# EAGLE schematic 1907022249-Dev Board (EAGLE 9.4.2)
DRAFTER: David Antaki; REV: 1; STATUS: ISSUED FOR REVIEW

## Sheet 1 of 3
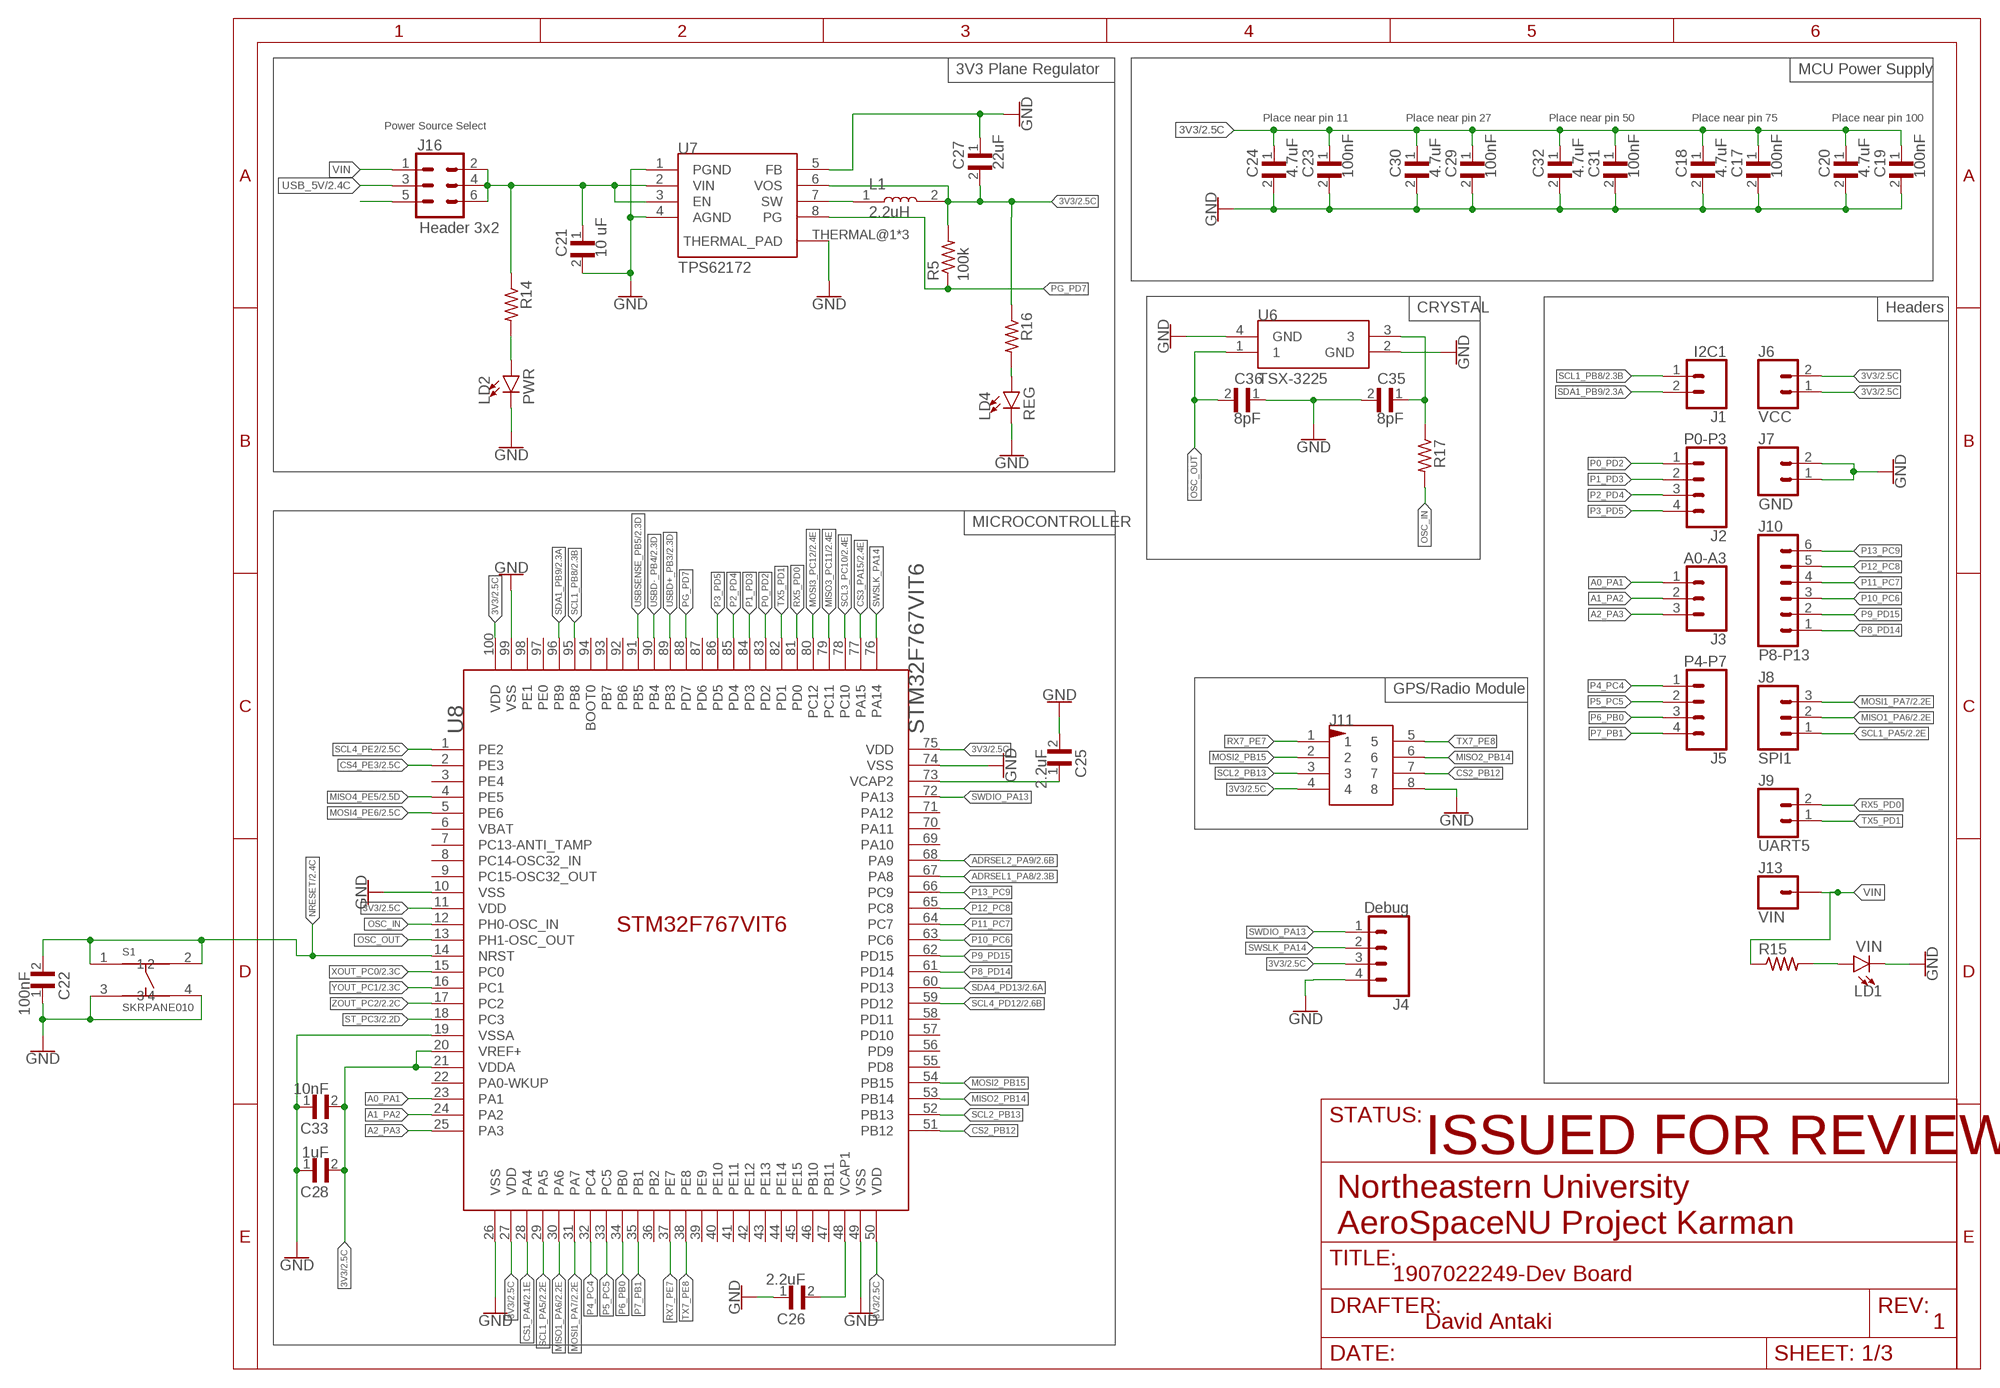
[diagram p0: schematic, sheet 1]

### Parts
C17  100nF  CGA3E2X7R1H104K080AD  [CAPC1608X95N]
C18  4.7uF  CGA3E2X7R1H104K080AD  [CAPC1608X95N]
C19  100nF  CGA3E2X7R1H104K080AD  [CAPC1608X95N]
C20  4.7uF  CGA3E2X7R1H104K080AD  [CAPC1608X95N]
C21  10 uF  CGA3E2X7R1H104K080AD  [CAPC1608X95N]
C22  100nF  CGA3E2X7R1H104K080AD  [CAPC1608X95N]
C23  100nF  CGA3E2X7R1H104K080AD  [CAPC1608X95N]
C24  4.7uF  CGA3E2X7R1H104K080AD  [CAPC1608X95N]
C25  2.2uF  CGA3E2X7R1H104K080AD  [CAPC1608X95N]
C26  2.2uF  CGA3E2X7R1H104K080AD  [CAPC1608X95N]
C27  22uF  CGA3E2X7R1H104K080AD  [CAPC1608X95N]
C28  1uF  CGA3E2X7R1H104K080AD  [CAPC1608X95N]
C29  100nF  CGA3E2X7R1H104K080AD  [CAPC1608X95N]
C30  4.7uF  CGA3E2X7R1H104K080AD  [CAPC1608X95N]
C31  100nF  CGA3E2X7R1H104K080AD  [CAPC1608X95N]
C32  4.7uF  CGA3E2X7R1H104K080AD  [CAPC1608X95N]
C33  10nF  CGA3E2X7R1H104K080AD  [CAPC1608X95N]
C35  8pF  CGA3E2X7R1H104K080AD  [CAPC1608X95N]
C36  8pF  CGA3E2X7R1H104K080AD  [CAPC1608X95N]
J1  I2C1  CONN_02  [1X02]
J2  P0-P3  CONN_04  [1X04]
J3  A0-A3  CONN_03  [1X03]
J4  Debug  CONN_04  [1X04]
J5  P4-P7  CONN_04  [1X04]
J6  VCC  CONN_02  [1X02]
J7  GND  CONN_02  [1X02]
J8  SPI1  CONN_03  [1X03]
J9  UART5  CONN_02  [1X02]
J10  P8-P13  CONN_06SILK_FEMALE_PTH  [1X06]
J11  087831-0819  [87831-0819]
J13  VIN  CONN_01  [1X01]
J16  Header 3x2  CONN_03X22X3_SILK_MALE_PTH  [2X3]
L1  2.2uH  MLF1608E100J  [INDC1608X95N]
LD1  VIN  0805_LED  [0805_LED]
LD2  PWR  0805_LED  [0805_LED]
LD4  REG  0805_LED  [0805_LED]
R5  100k  CRGH0603F221K  [RESC1608X50N]
R14  CRGH0603F221K  [RESC1608X50N]
R15  CRGH0603F221K  [RESC1608X50N]
R16  CRGH0603F221K  [RESC1608X50N]
R17  CRGH0603F221K  [RESC1608X50N]
S1  SKRPANE010  PUSHBUTTONSKRPANE010  [SKRPANE010]
U6  TSX-3225  [TSX-3225]
U7  TPS62172  [TPS62172]
U8  STM32F767VIT6  [LQFP100_14X14]

### Nets
3V3: C17.1 C18.1 C19.1 C20.1 C23.1 C24.1 C27.2 C28.2 C29.1 C30.1 C31.1 C32.1 C33.2 J4.3 J6.1 J6.2 J11.4 L1.2 R5.2 R16.1 U7.6(VOS) U8.11(VDD) U8.20(VREF+) U8.21(VDDA) U8.27(VDD) U8.50(VDD) U8.75(VDD) U8.100(VDD) ; also sheet 2
A0_PA1: J3.1 U8.23(PA1)
A1_PA2: J3.2 U8.24(PA2)
A2_PA3: J3.3 U8.25(PA3)
ADRSEL1_PA8: U8.67(PA8) ; also sheet 2
ADRSEL2_PA9: U8.68(PA9) ; also sheet 2
CS1_PA4: U8.28(PA4) ; also sheet 2
CS2_PB12: J11.7 U8.51(PB12)
CS3_PA15: U8.77(PA15) ; also sheet 2
CS4_PE3: U8.2(PE3) ; also sheet 2
GND: C17.2 C18.2 C19.2 C20.2 C21.2 C22.1 C23.2 C24.2 C25.2 C26.1 C28.1 C29.2 C30.2 C31.2 C32.2 C33.1 C35.2 C36.1 J4.4 J7.1 J7.2 J11.8 LD1.C LD2.C LD4.C S1.3 S1.4 U6.2(GND) U6.4(GND) U7.1(PGND) U7.4(AGND) U7.THERMAL@1(THERMAL_PAD) U7.THERMAL@2(THERMAL_PAD) U7.THERMAL@3(THERMAL_PAD) U8.10(VSS) U8.19(VSSA) U8.26(VSS) U8.49(VSS) U8.74(VSS) U8.99(VSS) ; also sheet 2
MISO1_PA6: J8.2 U8.30(PA6) ; also sheet 2
MISO2_PB14: J11.6 U8.53(PB14)
MISO3_PC11: U8.79(PC11) ; also sheet 2
MISO4_PE5: U8.4(PE5) ; also sheet 2
MOSI1_PA7: J8.3 U8.31(PA7) ; also sheet 2
MOSI2_PB15: J11.2 U8.54(PB15)
MOSI3_PC12: U8.80(PC12) ; also sheet 2
MOSI4_PE6: U8.5(PE6) ; also sheet 2
N$4: C25.1 U8.73(VCAP2)
N$7: C26.2 U8.48(VCAP1)
N$8: L1.1 U7.7(SW)
N$10: LD1.A R15.2
N$11: LD2.A R14.2
N$12: C27.1 U7.5(FB) ; supply symbol labelled GND
N$15: C35.1 R17.1 U6.3
N$17: J16.5
N$18: C21.1 J16.2 J16.4 J16.6 R14.1 U7.2(VIN) U7.3(EN)
N$23: LD4.A R16.2
NRESET: C22.2 S1.1 S1.2 U8.14(NRST) ; also sheet 2
OSC_IN: R17.2 U8.12(PH0-OSC_IN)
OSC_OUT: C36.2 U6.1 U8.13(PH1-OSC_OUT)
P0_PD2: J2.1 U8.83(PD2)
P1_PD3: J2.2 U8.84(PD3)
P2_PD4: J2.3 U8.85(PD4)
P3_PD5: J2.4 U8.86(PD5)
P4_PC4: J5.1 U8.32(PC4)
P5_PC5: J5.2 U8.33(PC5)
P6_PB0: J5.3 U8.34(PB0)
P7_PB1: J5.4 U8.35(PB1)
P8_PD14: J10.1 U8.61(PD14)
P9_PD15: J10.2 U8.62(PD15)
P10_PC6: J10.3 U8.63(PC6)
P11_PC7: J10.4 U8.64(PC7)
P12_PC8: J10.5 U8.65(PC8)
P13_PC9: J10.6 U8.66(PC9)
PG_PD7: R5.1 U7.8(PG) U8.88(PD7)
RX5_PD0: J9.2 U8.81(PD0)
RX7_PE7: J11.1 U8.37(PE7)
SCL1_PA5: J8.1 U8.29(PA5) ; also sheet 2
SCL1_PB8: J1.1 U8.95(PB8) ; also sheet 2
SCL2_PB13: J11.3 U8.52(PB13)
SCL3_PC10: U8.78(PC10) ; also sheet 2
SCL4_PD12: U8.59(PD12) ; also sheet 2
SCL4_PE2: U8.1(PE2) ; also sheet 2
SDA1_PB9: J1.2 U8.96(PB9) ; also sheet 2
SDA4_PD13: U8.60(PD13) ; also sheet 2
ST_PC3: U8.18(PC3) ; also sheet 2
SWDIO_PA13: J4.1 U8.72(PA13)
SWSLK_PA14: J4.2 U8.76(PA14)
TX5_PD1: J9.1 U8.82(PD1)
TX7_PE8: J11.5 U8.38(PE8)
USB_5V: J16.3 ; also sheet 2
USBD+_PB3: U8.89(PB3) ; also sheet 2
USBD-_PB4: U8.90(PB4) ; also sheet 2
USBSENSE_PB5: U8.91(PB5) ; also sheet 2
VIN: J13.1 J16.1 R15.1
XOUT_PC0: U8.15(PC0) ; also sheet 2
YOUT_PC1: U8.16(PC1) ; also sheet 2
ZOUT_PC2: U8.17(PC2) ; also sheet 2
Unconnected: U8.3(PE4) U8.6(VBAT) U8.7(PC13-ANTI_TAMP) U8.8(PC14-OSC32_IN) U8.9(PC15-OSC32_OUT) U8.22(PA0-WKUP) U8.36(PB2) U8.39(PE9) U8.40(PE10) U8.41(PE11) U8.42(PE12) U8.43(PE13) U8.44(PE14) U8.45(PE15) U8.46(PB10) U8.47(PB11) U8.55(PD8) U8.56(PD9) U8.57(PD10) U8.58(PD11) U8.69(PA10) U8.70(PA11) U8.71(PA12) U8.87(PD6) U8.92(PB6) U8.93(PB7) U8.94(BOOT0) U8.97(PE0) U8.98(PE1)

### Notes on the sheet
- 3V3 Plane Regulator | MCU Power Supply
- Place near pin 11 | Place near pin 27 | Place near pin 50 | Place near pin 75 | Place near pin 100
- Power Source Select
- CRYSTAL | Headers
- MICROCONTROLLER
- GPS/Radio Module

## Sheet 2 of 3
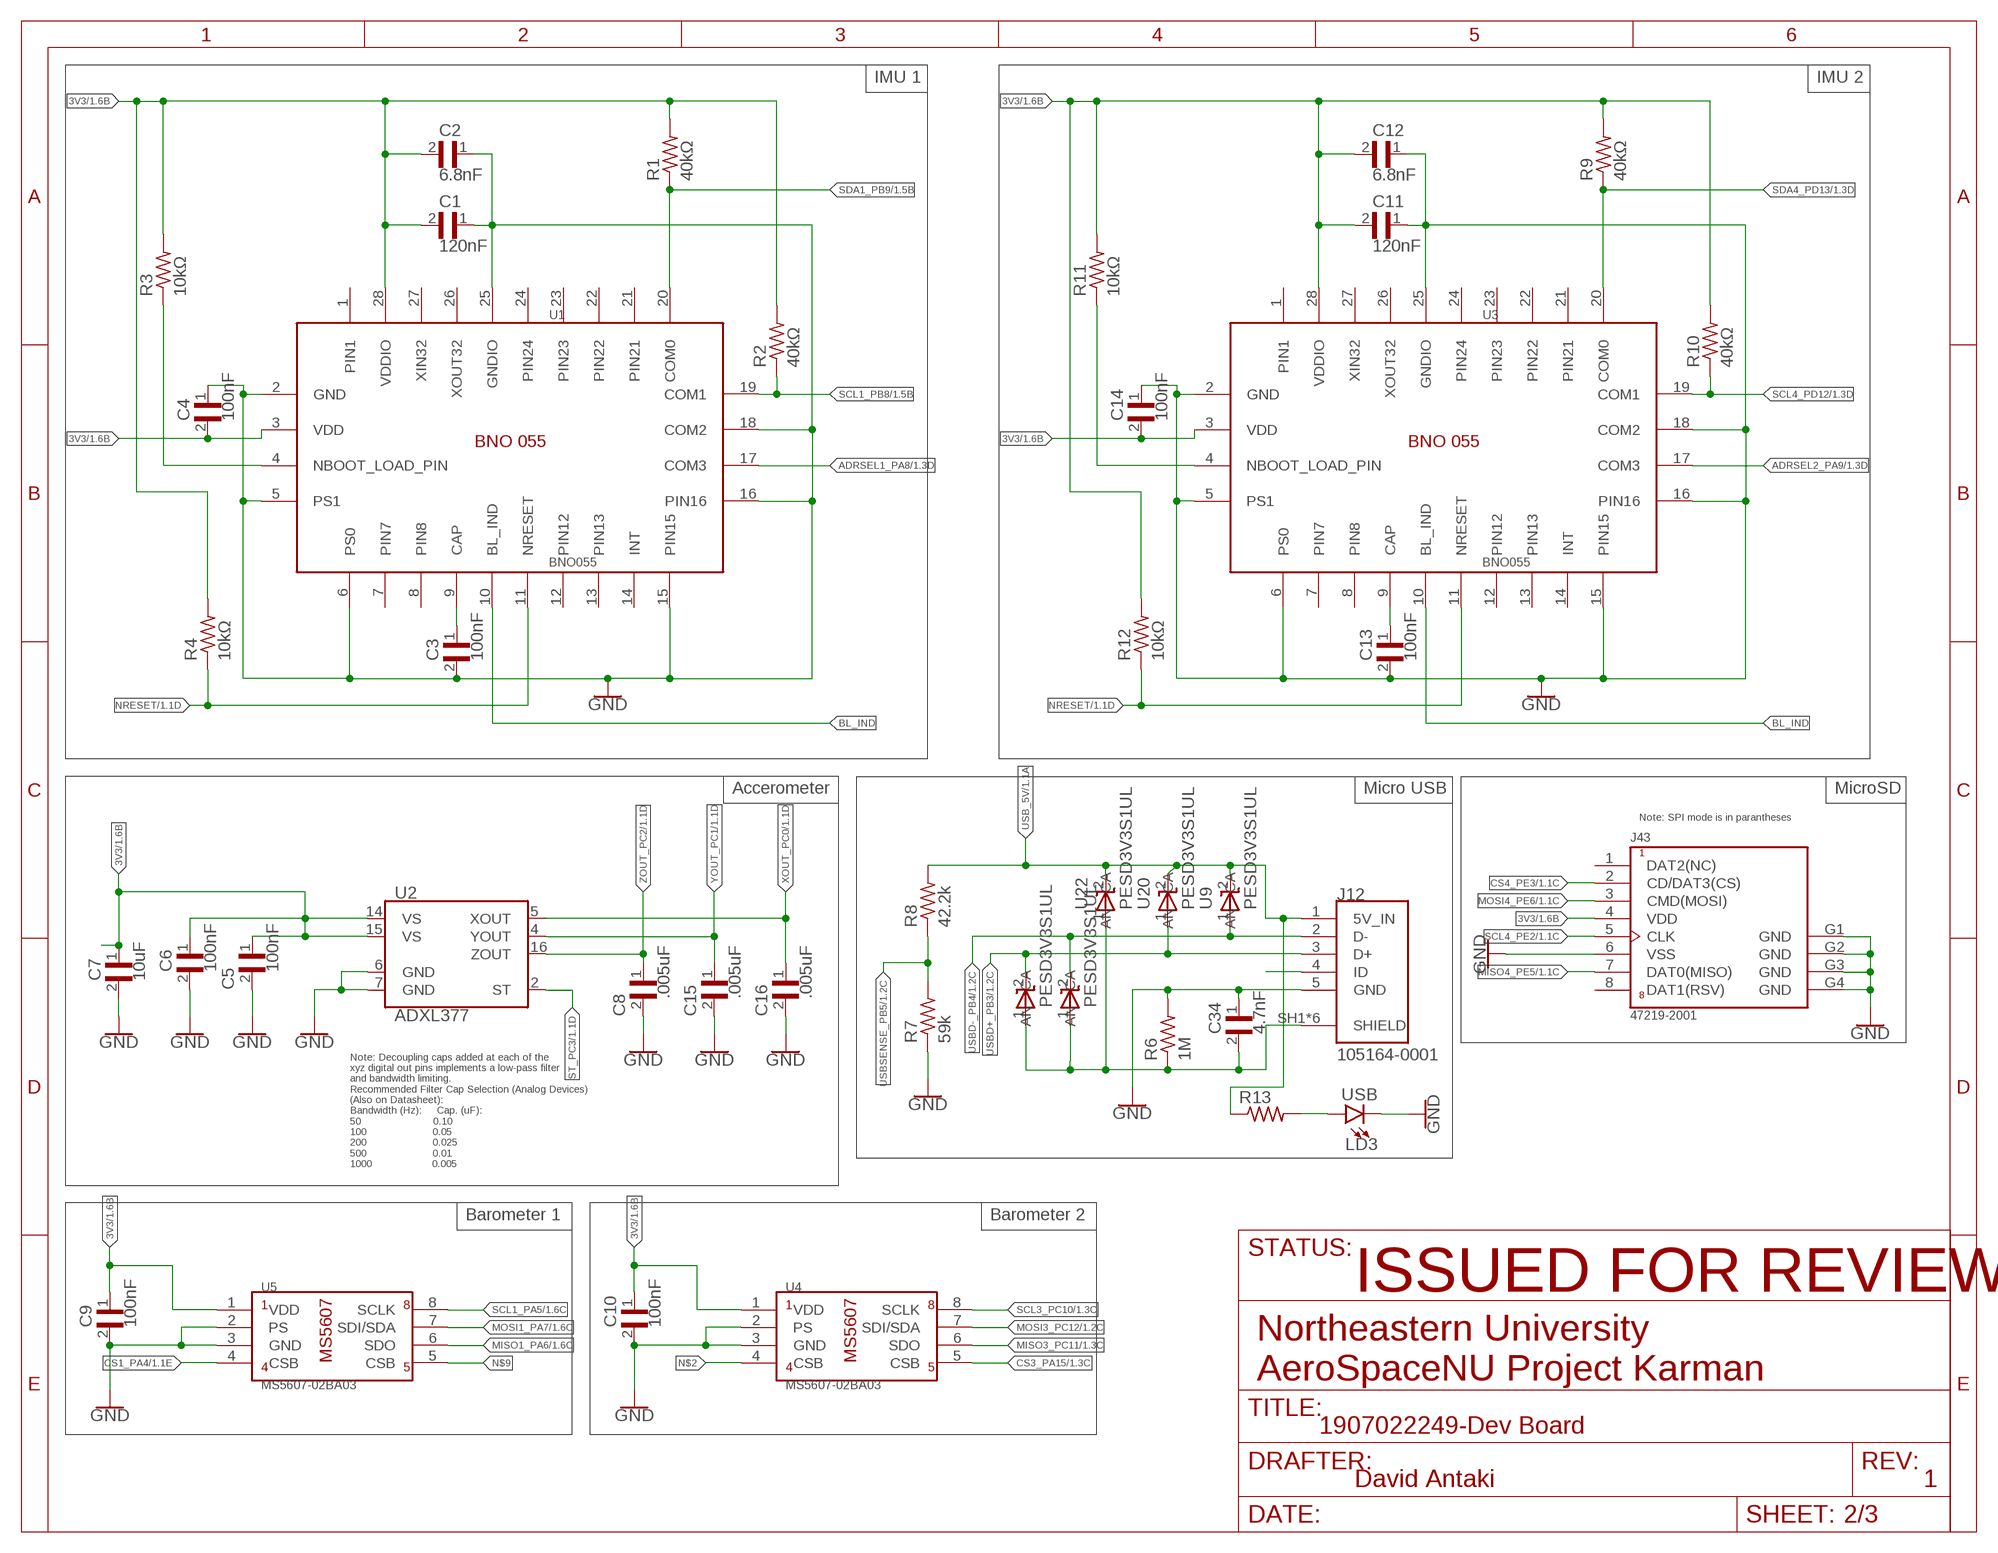
[diagram p1: schematic, sheet 2]

### Parts
C1  120nF  CGA3E2X7R1H104K080AD  [CAPC1608X95N]
C2  6.8nF  CGA3E2X7R1H104K080AD  [CAPC1608X95N]
C3  100nF  CGA3E2X7R1H104K080AD  [CAPC1608X95N]
C4  100nF  CGA3E2X7R1H104K080AD  [CAPC1608X95N]
C5  100nF  CGA3E2X7R1H104K080AD  [CAPC1608X95N]
C6  100nF  CGA3E2X7R1H104K080AD  [CAPC1608X95N]
C7  10uF  CGA3E2X7R1H104K080AD  [CAPC1608X95N]
C8  .005uF  CGA3E2X7R1H104K080AD  [CAPC1608X95N]
C9  100nF  CGA3E2X7R1H104K080AD  [CAPC1608X95N]
C10  100nF  CGA3E2X7R1H104K080AD  [CAPC1608X95N]
C11  120nF  CGA3E2X7R1H104K080AD  [CAPC1608X95N]
C12  6.8nF  CGA3E2X7R1H104K080AD  [CAPC1608X95N]
C13  100nF  CGA3E2X7R1H104K080AD  [CAPC1608X95N]
C14  100nF  CGA3E2X7R1H104K080AD  [CAPC1608X95N]
C15  .005uF  CGA3E2X7R1H104K080AD  [CAPC1608X95N]
C16  .005uF  CGA3E2X7R1H104K080AD  [CAPC1608X95N]
C34  4.7nF  CGA3E2X7R1H104K080AD  [CAPC1608X95N]
J12  105164-0001  [MOLEX_105164-0001]
J43  47219-2001  [MOLEX_47219-2001]
LD3  USB  0805_LED  [0805_LED]
R1  40kΩ  CRGH0603F221K  [RESC1608X50N]
R2  40kΩ  CRGH0603F221K  [RESC1608X50N]
R3  10kΩ  CRGH0603F221K  [RESC1608X50N]
R4  10kΩ  CRGH0603F221K  [RESC1608X50N]
R6  1M  CRGH0603F221K  [RESC1608X50N]
R7  59k  CRGH0603F221K  [RESC1608X50N]
R8  42.2k  CRGH0603F221K  [RESC1608X50N]
R9  40kΩ  CRGH0603F221K  [RESC1608X50N]
R10  40kΩ  CRGH0603F221K  [RESC1608X50N]
R11  10kΩ  CRGH0603F221K  [RESC1608X50N]
R12  10kΩ  CRGH0603F221K  [RESC1608X50N]
R13  CRGH0603F221K  [RESC1608X50N]
U1  BNO055  [LGA28R50P4X10_380X520X100]
U2  ADXL377  [LFCSP-16-3X3]
U3  BNO055  [LGA28R50P4X10_380X520X100]
U4  MS5607-02BA03  [TE_MS860702BA01-50]
U5  MS5607-02BA03  [TE_MS860702BA01-50]
U9  PESD3V3S1UL  [SOD882]
U20  PESD3V3S1UL  [SOD882]
U22  PESD3V3S1UL  [SOD882]
U23  PESD3V3S1UL  [SOD882]
U24  PESD3V3S1UL  [SOD882]

### Nets
3V3: C1.2 C2.2 C4.2 C5.1 C6.1 C7.1 C9.1 C10.1 C11.2 C12.2 C14.2 J43.4(VDD) R1.2 R2.2 R3.2 R4.2 R9.2 R10.2 R11.2 R12.2 U1.3(VDD) U1.28(VDDIO) U2.14(VS) U2.15(VS) U3.3(VDD) U3.28(VDDIO) U4.1(VDD) U5.1(VDD) ; also sheet 1
ADRSEL1_PA8: U1.17(COM3) ; also sheet 1
ADRSEL2_PA9: U3.17(COM3) ; also sheet 1
BL_IND: U1.10(BL_IND) U3.10(BL_IND)
CS1_PA4: U5.4(CSB) ; also sheet 1
CS3_PA15: U4.5(CSB) ; also sheet 1
CS4_PE3: J43.2(CD/DAT3(CS)) ; also sheet 1
GND: C1.1 C2.1 C3.2 C4.1 C5.2 C6.2 C7.2 C8.2 C9.2 C10.2 C11.1 C12.1 C13.2 C14.1 C15.2 C16.2 C34.1 J12.5(GND) J43.6(VSS) J43.G1(GND) J43.G2(GND) J43.G3(GND) J43.G4(GND) LD3.C R6.2 R7.1 U1.2(GND) U1.5(PS1) U1.6(PS0) U1.15(PIN15) U1.16(PIN16) U1.18(COM2) U1.25(GNDIO) U2.6(GND) U2.7(GND) U3.2(GND) U3.5(PS1) U3.6(PS0) U3.15(PIN15) U3.16(PIN16) U3.18(COM2) U3.25(GNDIO) U4.2(PS) U4.3(GND) U5.2(PS) U5.3(GND) ; also sheet 1
MISO1_PA6: U5.6(SDO) ; also sheet 1
MISO3_PC11: U4.6(SDO) ; also sheet 1
MISO4_PE5: J43.7(DAT0(MISO)) ; also sheet 1
MOSI1_PA7: U5.7(SDI/SDA) ; also sheet 1
MOSI3_PC12: U4.7(SDI/SDA) ; also sheet 1
MOSI4_PE6: J43.3(CMD(MOSI)) ; also sheet 1
N$1: C3.1 U1.9(CAP)
N$2: U4.4(CSB)
N$3: R3.1 U1.4(NBOOT_LOAD_PIN)
N$5: C13.1 U3.9(CAP)
N$6: R11.1 U3.4(NBOOT_LOAD_PIN)
N$9: U5.5(CSB)
N$13: J12.4(ID)
N$14: C34.2 J12.SH1(SHIELD) J12.SH2(SHIELD) J12.SH3(SHIELD) J12.SH4(SHIELD) J12.SH5(SHIELD) J12.SH6(SHIELD) R6.1 U22.1(CA) U23.1(CA) U24.1(CA)
N$20: LD3.A R13.2
NRESET: R4.1 R12.1 U1.11(NRESET) U3.11(NRESET) ; also sheet 1
SCL1_PA5: U5.8(SCLK) ; also sheet 1
SCL1_PB8: R2.1 U1.19(COM1) ; also sheet 1
SCL3_PC10: U4.8(SCLK) ; also sheet 1
SCL4_PD12: R10.1 U3.19(COM1) ; also sheet 1
SCL4_PE2: J43.5(CLK) ; also sheet 1
SDA1_PB9: R1.1 U1.20(COM0) ; also sheet 1
SDA4_PD13: R9.1 U3.20(COM0) ; also sheet 1
ST_PC3: U2.2(ST) ; also sheet 1
USB_5V: J12.1(5V_IN) R8.2 R13.1 U9.2(AN) U20.2(AN) U22.2(AN) ; also sheet 1
USBD+_PB3: J12.3(D+) U20.1(CA) U24.2(AN) ; also sheet 1
USBD-_PB4: J12.2(D-) U9.1(CA) U23.2(AN) ; also sheet 1
USBSENSE_PB5: R7.2 R8.1 ; also sheet 1
XOUT_PC0: C16.1 U2.5(XOUT) ; also sheet 1
YOUT_PC1: C15.1 U2.4(YOUT) ; also sheet 1
ZOUT_PC2: C8.1 U2.16(ZOUT) ; also sheet 1
Unconnected: J43.1(DAT2(NC)) J43.8(DAT1(RSV)) U1.1(PIN1) U1.12(PIN12) U1.13(PIN13) U1.14(INT) U1.26(XOUT32) U3.1(PIN1) U3.12(PIN12) U3.13(PIN13) U3.14(INT) U3.26(XOUT32)

### Notes on the sheet
- IMU 1 | IMU 2
- Accerometer | Micro USB | MicroSD
- Note: Decoupling caps added at each of the
  xyz digital out pins implements a low-pass filter
  and bandwidth limiting.
  Recommended Filter Cap Selection (Analog Devices)
  (Also on Datasheet):
  Bandwidth (Hz):     Cap. (uF):
  50                        0.10
  100                      0.05
  200                      0.025
  500                      0.01
  1000                    0.005
- Barometer 1 | Barometer 2

## Sheet 3 of 3
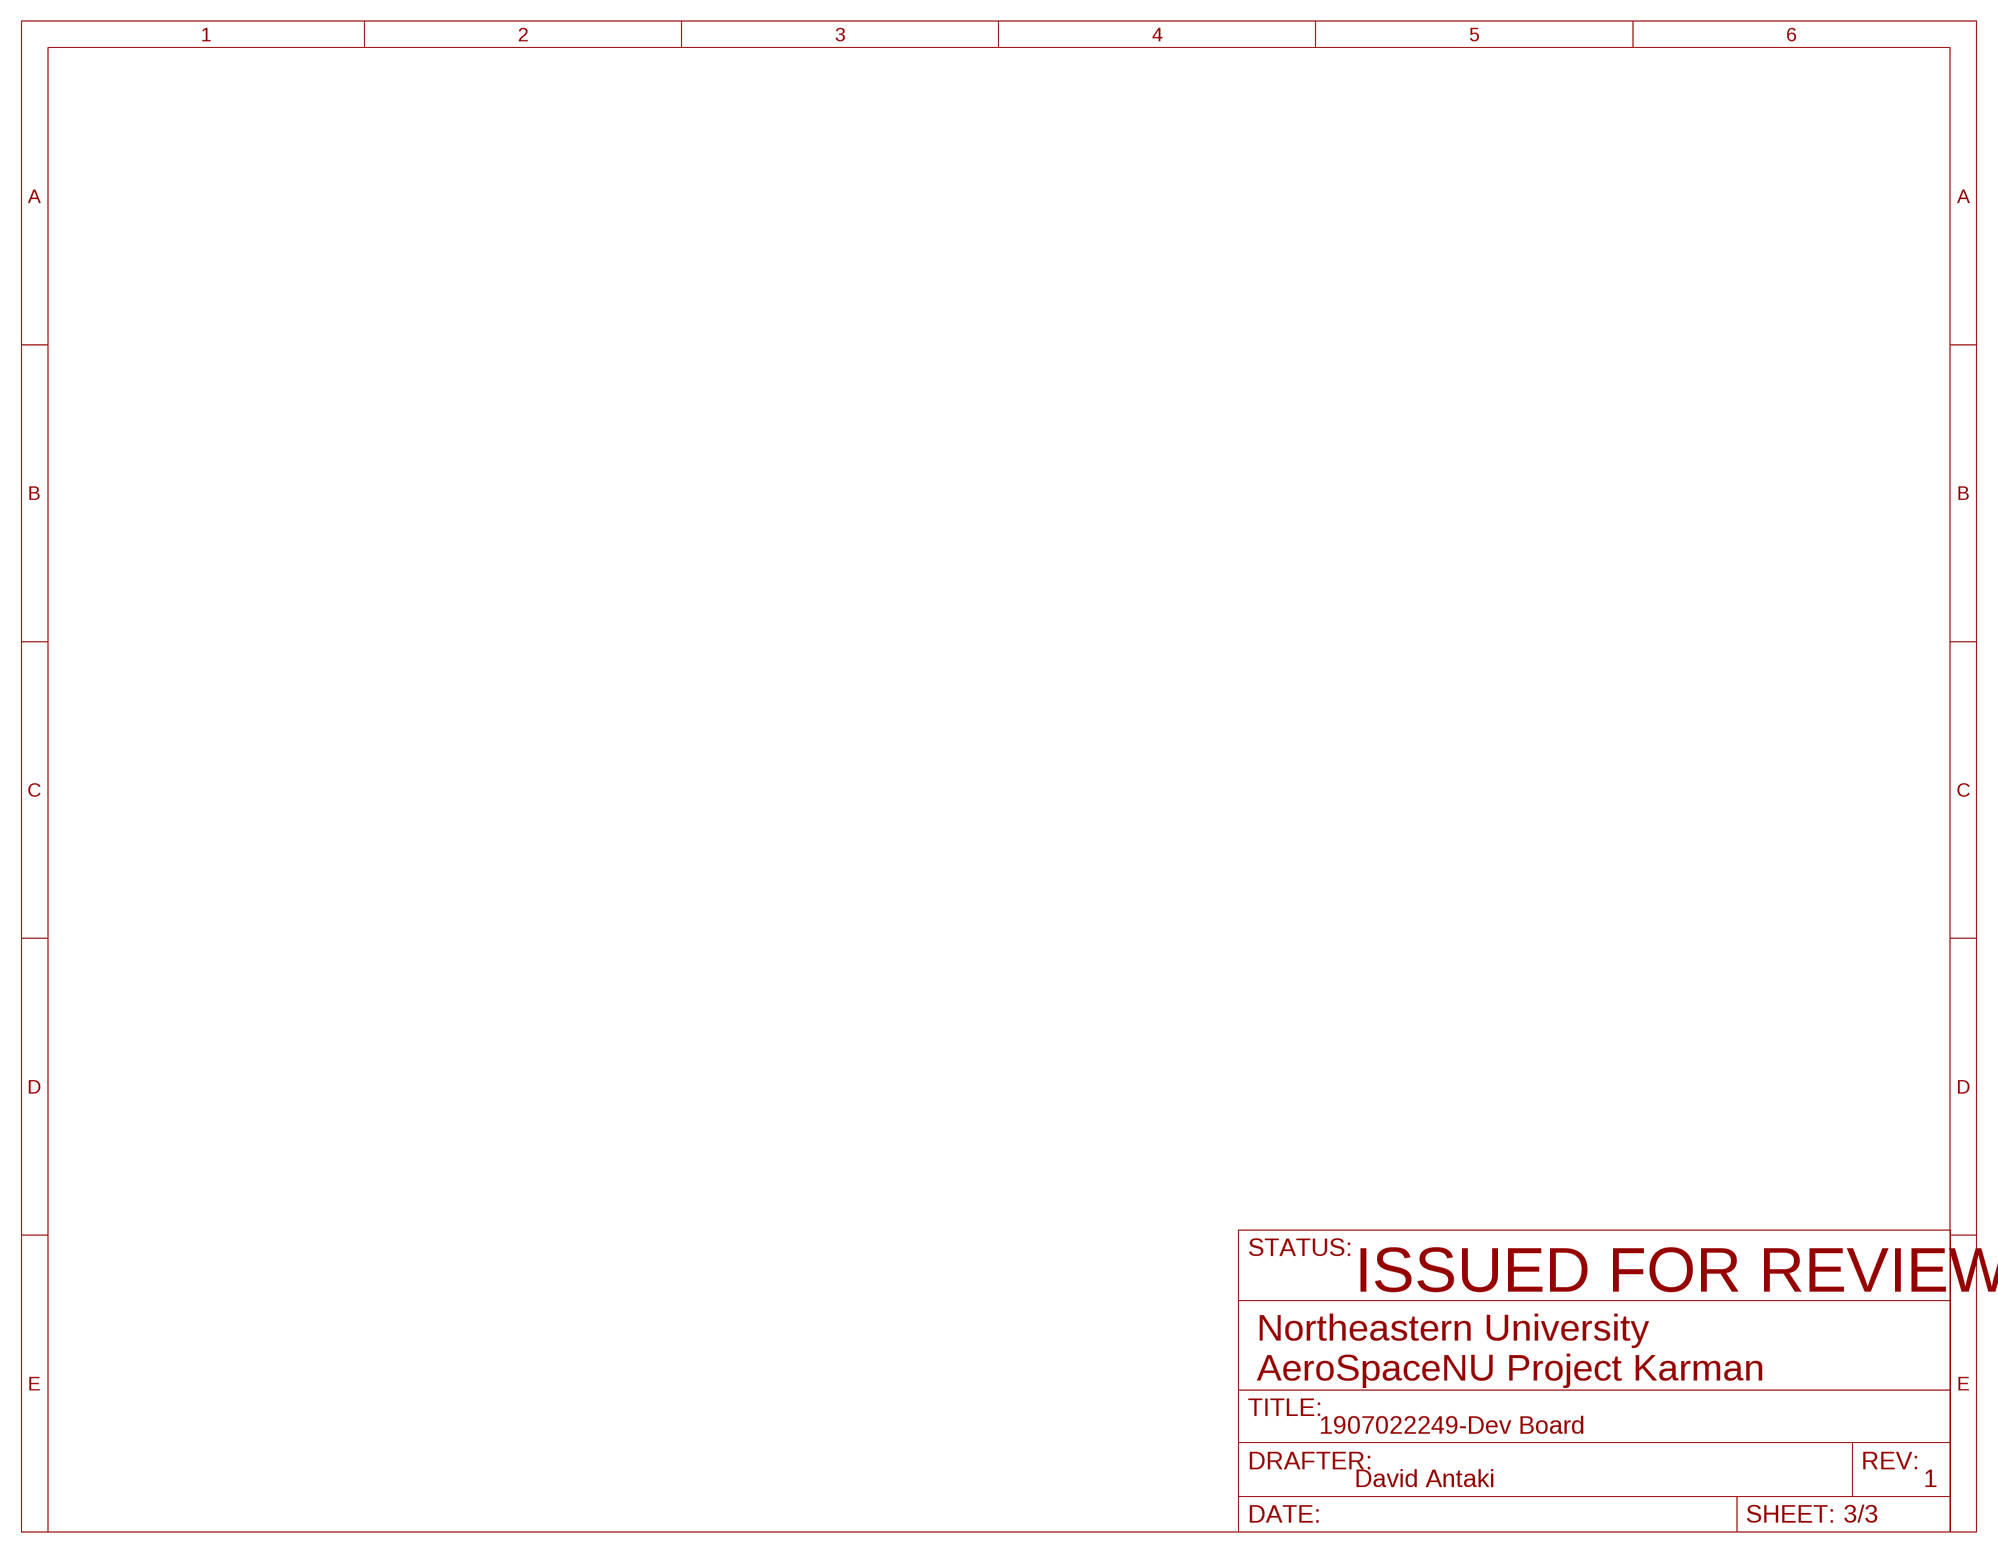
[diagram p2: schematic, sheet 3]

## Power pins joined to a net without a drawn wire
PIN7: U1.7(PIN7) U3.7(PIN7)
PIN8: U1.8(PIN8) U3.8(PIN8)
PIN21: U1.21(PIN21) U3.21(PIN21)
PIN22: U1.22(PIN22) U3.22(PIN22)
PIN23: U1.23(PIN23) U3.23(PIN23)
PIN24: U1.24(PIN24) U3.24(PIN24)
XIN32: U1.27(XIN32) U3.27(XIN32)

## Library data of the parts
C1-C36 = CGA3E2X7R1H104K080AD:CGA3E2X7R1H104K080AD: CGA Series 0603 0.1 uF 50 V ±10% X7R SMT Multilayer Ceramic Capacitor; AVAILABILITY: Unavailable; DESCRIPTION: CGA Series 0603 0.1 uF 50 V ±10% X7R SMT Multilayer Ceramic Capacitor; MF: TDK; MP: CGA3E2X7R1H104K080AD; PACKAGE: 0603 TDK; PRICE: None
J1 J6 J7 J9 = SparkFun-Connectors:CONN_02: Multi connection point. Often used as Generic Header-pin footprint for 0.1 inch spaced/style header connections On any of the 0.1 inch spaced packages, you can populate with these: Break Away Headers - Straight <https://www.sparkfun.com/products/116> (PRT-00116) Break Away Male Headers - Right Angle <https://www.sparkfun.com/products/553> (PRT-00553) Female Headers <https://www.sparkfun.com/products/115> (PRT-00115) Break Away Headers - Machine Pin <https://www.sparkfun.com/products/117> (PRT-00117) Break Away Female Headers - Swiss Machine Pin <https://www.sparkfun.com/products/743> (PRT-00743) For SCREWTERMINALS and SPRING TERMINALS visit here: Screw Terimnals on SparkFun.com <https://www.sparkfun.com/search/results?term=Screw+Terminals> (5mm/3.5mm/2.54mm spacing) This device is also useful as a general connection point to wire up your design to another part of your project. Our various solder wires solder well into these plated through hole pads. Hook-Up Wire - Assortment (Stranded, 22 AWG) <https://www.sparkfun.com/products/11375> (PRT-11375) Hook-Up Wire - Assortment (Solid Core, 22 AWG) <https://www.sparkfun.com/products/11367> (PRT-11367) View the entire wire category on our website here <https://www.sparkfun.com/categories/141> Special notes: Molex polarized connector foot print use with: PRT-08233 with associated crimp pins and housings. 2.54_SCREWTERM for use with PRT-10571. 3.5mm Screw Terminal footprints for PRT-08084 5mm Screw Terminal footprints for use with PRT-08432
J2 J4 J5 = SparkFun-Connectors:CONN_04: Multi connection point. Often used as Generic Header-pin footprint for 0.1 inch spaced/style header connections On any of the 0.1 inch spaced packages, you can populate with these: Break Away Headers - Straight <https://www.sparkfun.com/products/116> (PRT-00116) Break Away Male Headers - Right Angle <https://www.sparkfun.com/products/553> (PRT-00553) Female Headers <https://www.sparkfun.com/products/115> (PRT-00115) Break Away Headers - Machine Pin <https://www.sparkfun.com/products/117> (PRT-00117) Break Away Female Headers - Swiss Machine Pin <https://www.sparkfun.com/products/743> (PRT-00743) For SCREWTERMINALS and SPRING TERMINALS visit here: Screw Terimnals on SparkFun.com <https://www.sparkfun.com/search/results?term=Screw+Terminals> (5mm/3.5mm/2.54mm spacing) This device is also useful as a general connection point to wire up your design to another part of your project. Our various solder wires solder well into these plated through hole pads. Hook-Up Wire - Assortment (Stranded, 22 AWG) <https://www.sparkfun.com/products/11375> (PRT-11375) Hook-Up Wire - Assortment (Solid Core, 22 AWG) <https://www.sparkfun.com/products/11367> (PRT-11367) View the entire wire category on our website here <https://www.sparkfun.com/categories/141> Special notes: Molex polarized connector foot print use with SKU : PRT-08231 with associated crimp pins and housings. 1MM SMD Version SKU: PRT-10208; PROD_ID: CONN-09696
J3 J8 = SparkFun-Connectors:CONN_03: Multi connection point. Often used as Generic Header-pin footprint for 0.1 inch spaced/style header connections On any of the 0.1 inch spaced packages, you can populate with these: Break Away Headers - Straight <https://www.sparkfun.com/products/116> (PRT-00116) Break Away Male Headers - Right Angle <https://www.sparkfun.com/products/553> (PRT-00553) Female Headers <https://www.sparkfun.com/products/115> (PRT-00115) Break Away Headers - Machine Pin <https://www.sparkfun.com/products/117> (PRT-00117) Break Away Female Headers - Swiss Machine Pin <https://www.sparkfun.com/products/743> (PRT-00743) Stackable Header - 3 Pin (Female, 0.1") <https://www.sparkfun.com/products/13875> (PRT-13875) For SCREWTERMINALS and SPRING TERMINALS visit here: Screw Terimnals on SparkFun.com <https://www.sparkfun.com/search/results?term=Screw+Terminals> (5mm/3.5mm/2.54mm spacing) This device is also useful as a general connection point to wire up your design to another part of your project. Our various solder wires solder well into these plated through hole pads. Hook-Up Wire - Assortment (Stranded, 22 AWG) <https://www.sparkfun.com/products/11375> (PRT-11375) Hook-Up Wire - Assortment (Solid Core, 22 AWG) <https://www.sparkfun.com/products/11367> (PRT-11367) View the entire wire category on our website here <https://www.sparkfun.com/categories/141> Special notes: Molex polarized connector foot print use with SKU : PRT-08232 with associated crimp pins and housings.
J10 = SparkFun-Connectors:CONN_06: Multi connection point. Often used as Generic Header-pin footprint for 0.1 inch spaced/style header connections On any of the 0.1 inch spaced packages, you can populate with these: Break Away Headers - Straight <https://www.sparkfun.com/products/116> (PRT-00116) Break Away Male Headers - Right Angle <https://www.sparkfun.com/products/553> (PRT-00553) Female Headers <https://www.sparkfun.com/products/115> (PRT-00115) Break Away Headers - Machine Pin <https://www.sparkfun.com/products/117> (PRT-00117) Break Away Female Headers - Swiss Machine Pin <https://www.sparkfun.com/products/743> (PRT-00743) Arduino Stackable Header - 6 Pin <https://www.sparkfun.com/products/9280> (PRT-09280) For SCREWTERMINALS and SPRING TERMINALS visit here: Screw Terimnals on SparkFun.com <https://www.sparkfun.com/search/results?term=Screw+Terminals> (5mm/3.5mm/2.54mm spacing) This device is also useful as a general connection point to wire up your design to another part of your project. Our various solder wires solder well into these plated through hole pads. Hook-Up Wire - Assortment (Stranded, 22 AWG) <https://www.sparkfun.com/products/11375> (PRT-11375) Hook-Up Wire - Assortment (Solid Core, 22 AWG) <https://www.sparkfun.com/products/11367> (PRT-11367) View the entire wire category on our website here <https://www.sparkfun.com/categories/141>; PROD_ID: CONN-08437
J11 = Molex:087831-0819
J12 = 105164-0001:105164-0001: Micro-USB B Receptacle without Flange, Top Mount, Surface Mount, Lead-Free; AVAILABILITY: Unavailable; DESCRIPTION: Micro-USB B Receptacle without Flange, Top Mount, Surface Mount, Lead-Free; MF: Molex; MP: 105164-0001; PACKAGE: None; PRICE: None
J13 = SparkFun-Connectors:CONN_01: Single connection point. Often used as Generic Header-pin footprint for 0.1 inch spaced/style header connections On any of the 0.1 inch spaced packages, you can populate with these: Break Away Headers - Straight <https://www.sparkfun.com/products/116> (PRT-00116) Break Away Male Headers - Right Angle <https://www.sparkfun.com/products/553> (PRT-00553) Female Headers <https://www.sparkfun.com/products/115> (PRT-00115) Break Away Headers - Machine Pin <https://www.sparkfun.com/products/117> (PRT-00117) Break Away Female Headers - Swiss Machine Pin <https://www.sparkfun.com/products/743> (PRT-00743) This device is also useful as a general connection point to wire up your design to another part of your project. Our various solder wires solder well into these plated through hole pads. Hook-Up Wire - Assortment (Stranded, 22 AWG) <https://www.sparkfun.com/products/11375> (PRT-11375) Hook-Up Wire - Assortment (Solid Core, 22 AWG) <https://www.sparkfun.com/products/11367> (PRT-11367) View the entire wire category on our website here <https://www.sparkfun.com/categories/141> Special notes: SMTSO-256-ET is a "flush mount" nut for a 4-40 screw. We mostly use this on specialty testbeds; it is a nice way to connect hardware to your PCB at an adjustable hieght. Also note, the SNAP packages are for using a snappable style connector. We sell a baggie of snaps and they are also used on two LilyPad designs: Snap Assortment - 30 pack (male and female) <https://www.sparkfun.com/products/11347> (DEV-11347) LilyPad Arduino SimpleSnap <https://www.sparkfun.com/products/10941> (DEV-10941) LilyPad SimpleSnap Protoboard <https://www.sparkfun.com/products/10940> (DEV-10940)
J16 = SparkFun-Connectors:CONN_03X2: Multi connection point. Often used as Generic Header-pin footprint for 0.1 inch spaced/style header connections You can populate with any combo of single row headers, but if you'd like an exact match, check these: Header - 2x3 (Male, 0.1") <https://www.sparkfun.com/products/12807> (PRT-12807) Header - 2x3 (Female, 0.1") <https://www.sparkfun.com/products/13010> (PRT-13010) 2x3 Pin Shrouded Header <https://www.sparkfun.com/products/10877> (PRT-10877) On any of the 0.1 inch spaced packages, you can populate with these: Break Away Headers - Straight <https://www.sparkfun.com/products/116> (PRT-00116) Break Away Male Headers - Right Angle <https://www.sparkfun.com/products/553> (PRT-00553) Female Headers <https://www.sparkfun.com/products/115> (PRT-00115) Break Away Headers - Machine Pin <https://www.sparkfun.com/products/117> (PRT-00117) Break Away Female Headers - Swiss Machine Pin <https://www.sparkfun.com/products/743> (PRT-00743) Special note: the shrouded connector mates well with our 3x2 ribbon cables: Ribbon Crimp Connector - 6-pin (2x3, Female) <https://www.sparkfun.com/products/10651> (PRT-10651) Ribbon Cable - 6 wire (15ft) <https://www.sparkfun.com/products/10646> (PRT-10646); PROD_ID: CONN-09701
J43 = 47219-2001:47219-2001: 1.10mm Pitch microSD Card Connector, Hinge Type, Lead-Free http://www.snapeda.com/parts/47219-2001/Molex%20/%20Waldom/view-part/#; AVAILABILITY: Unavailable; DESCRIPTION: Conn Micro SD Card SKT 8 POS 1.1mm Solder RA SMD 0.5A/Contact Embossed T/R; MF: Molex; MP: 47219-2001; PACKAGE: None; PRICE: None
L1 = 0603_Inductor:MLF1608E100J: Ind Shielded Multi-Layer 10uH 5% 2MHz 30Q-Factor Ferrite 10mA 0603; AVAILABILITY: Unavailable; DESCRIPTION: Inductor RF Chip Shielded Multi-Layer 10uH 5% 2MHz 30Q-Factor Ferrite 10mA 1.7Ohm DCR 0603 T/R; MF: TDK; MP: MLF1608E100J; PACKAGE: 0603 TDK; PRICE: None
LD1-LD4 = 0805_LED:0805_LED: Generic 0805 Package LED Made by David Antaki
R1-R4 R9-R12 = CRGH0603F221K:CRGH0603F221K: Res Thick Film 0603 221K Ohm 1% 1/5W ±100ppm/°C Molded SMD SMD T/R; AVAILABILITY: Unavailable; COMMENT: 2-1879507-2; DESCRIPTION: Res Thick Film 0603 221K Ohm 1% 1/5W ±100ppm/°C Molded SMD SMD T/R; MF: TE Connectivity; MP: CRGH0603F221K; PACKAGE: 0603 TE Connectivity; PRICE: None; TE_PURCHASE_URL: https://www.te.com/usa-en/product-2-1879507-2.html?te_bu=Cor&te_type=disp&te_campaign=seda_glo_cor-seda-global-disp-prtnr-fy19-seda-model-bom-cta_sma-317_1&elqCampaignId=32493
R5-R8 R13-R17 = 0603_Resistor:CRGH0603F221K: Res Thick Film 0603 221K Ohm 1% 1/5W ±100ppm/°C Molded SMD SMD T/R; AVAILABILITY: Unavailable; COMMENT: 2-1879507-2; DESCRIPTION: Res Thick Film 0603 221K Ohm 1% 1/5W ±100ppm/°C Molded SMD SMD T/R; MF: TE Connectivity; MP: CRGH0603F221K; PACKAGE: 0603 TE Connectivity; PRICE: None; TE_PURCHASE_URL: https://www.te.com/usa-en/product-2-1879507-2.html?te_bu=Cor&te_type=disp&te_campaign=seda_glo_cor-seda-global-disp-prtnr-fy19-seda-model-bom-cta_sma-317_1&elqCampaignId=32493
S1 = LL3301BF065QJ:PUSHBUTTON: LL3301BF065QJ Push Button Switch Datasheet <https://www.mouser.com/datasheet/2/140/P010455D-267754.pdf> Made by David Antaki
U1 U3 = BNO055:BNO055: BNO055 9-axis Absolute Orientation Sensor ( SiP ) w/Sensors and Sensor Fusion; AVAILABILITY: Unavailable; DESCRIPTION: BNO055 9-axis Absolute Orientation Sensor _ SiP _ w/Sensors and Sensor Fusion; MF: Bosch; MP: BNO055; PACKAGE: LGA-28 Bosch; PRICE: None
U2 = ADXL377:ADXL377: Analog Devices ADXL377 Low Power 3-Axis ±200 g Accelerometer with Analog Output The ADXL377 is a small, thin, low power, complete 3-axis accelerometer with signal conditioned voltage outputs. The ADXL377 measures acceleration resulting from motion, shock, or vibration with a typical full-scale range of ±200g. Datasheet <https://cdn.sparkfun.com/datasheets/Sensors/Accelerometers/ADXL377.pdf> SparkFun Products SparkFun Triple Axis Accelerometer Breakout - ADXL377 <https://www.sparkfun.com/products/12803> (SEN-12803); AVAILABILITY: Unavailable; DESCRIPTION: ADI Small, Low Power, 3-Axis +/-3g3x3x1.45mm; MF: Analog Devices; MP: ADXL377; PACKAGE: None; PRICE: None
U4 U5 = MS5607-02BA03:MS5607-02BA03
U6 = TSX-3225 16.0000MF09Z-AC0:TSX-3225
U7 = TPS62172:TPS62172
U8 = STM32F767VIT6:STM32F767VIT6
U9 U20 U22-U24 = PESD3V3S1UL:PESD3V3S1UL: PESD3V3S1UL Zener Diode Made by David Antaki Digikey <https://www.digikey.com/product-detail/en/nexperia-usa-inc/PESD3V3S1UL315/1727-5353-1-ND/2676832> Datasheet <https://assets.nexperia.com/documents/data-sheet/PESDXS1UL_SER.pdf>